# Altium schematic sheet ProbadorDeCables_Accesorios_B_SZCNT_2.SchDoc
size A4
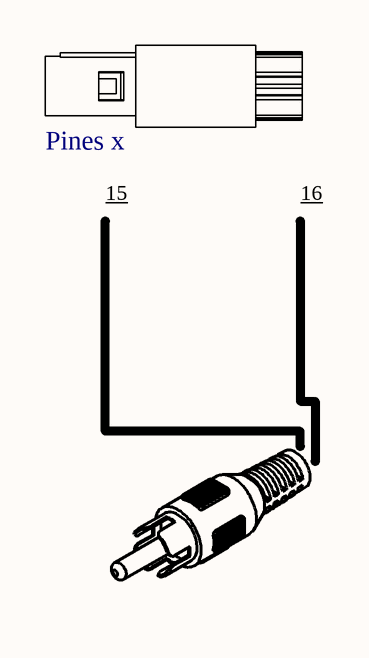
[diagram p0: ProbadorDeCables_Accesorios_B_SZCNT_2.SchDoc]

## Parts
B_SZCNT2  Pines: Pines x  [BOM_SZCNT_Macho]  (hidden comment: SZCNT_0x_Macho)  (mechanical)
BOM_B_SZCNT2  RCP-021__Negro  [BOM_RCP-021__Negro]  (value not drawn)  (mechanical)

## Notes on the sheet
- (near B_SZCNT2) 15
- 16

## Library data of the parts
B_SZCNT2 = SZCNT_0x_Macho: Conector SZCNT x vías macho para cable; Cod.DigiKey: Se compra a SZCNT; Cod.Fabricante: *; ComponentLink1Description: Manufacturer Link; ComponentLink1URL: *; DIGIKEYx100: *; Fabricante: SZCNT; DIGIKEYx50: *
BOM_B_SZCNT2 = RCP-021__Negro: CONN RCA PLUG MONO 2COND; Fabricante: CUI Devices; Cod.DigiKey: CP-1453-ND; Cod.Fabricante: RCP-021; ComponentLink1Description: Manufacturer Link; ComponentLink1URL: https://www.cuidevices.com/product/resource/digikeypdf/rcp-02x.pdf; DIGIKEYx50: 1.09940; DIGIKEYx100: 1.05160